# Altium project UTAT_data handling.PrjPcb
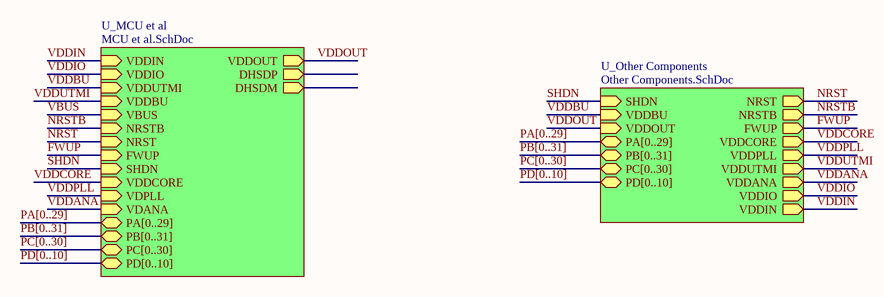
[diagram p0: Top Level.SchDoc]
3 sheets, 168 parts. Net scope: hierarchical (ports join the sheet entries above them; power ports are global).
Board files: UTAT_data handling.PcbDoc, UTAT_data handling_v1.pc.PcbDoc
Sheets:
  Top Level.SchDoc
    U_MCU et al = MCU et al.SchDoc
    U_Other Components = Other Components.SchDoc

## Sheet Top Level.SchDoc
size A

### Sub-sheets
U_MCU et al = MCU et al.SchDoc: VDDOUT (out), VDDIN (in), VDDIO (in), VDDUTMI (in), VDDBU (in), DHSDP (out), DHSDM (out), VBUS (in), NRSTB (in), NRST (in), FWUP (in), SHDN (in), VDDCORE (in), VDPLL (in), VDANA (in), PA[0..29] (bidir), PB[0..31] (bidir), PC[0..30] (bidir), PD[0..10] (bidir)
U_Other Components = Other Components.SchDoc: SHDN (in), NRST (out), NRSTB (out), VDDBU (in), FWUP (out), VDDOUT (in), VDDCORE (out), VDDPLL (out), VDDUTMI (out), VDDANA (out), VDDIO (out), VDDIN (out), PA[0..29] (bidir), PB[0..31] (bidir), PC[0..30] (bidir), PD[0..10] (bidir)

### Nets
FWUP: sheet U_MCU et al/FWUP, sheet U_Other Components/FWUP
NRST: sheet U_MCU et al/NRST, sheet U_Other Components/NRST
NRSTB: sheet U_MCU et al/NRSTB, sheet U_Other Components/NRSTB
SHDN: sheet U_MCU et al/SHDN, sheet U_Other Components/SHDN  [project net PT5]
VDDANA: sheet U_MCU et al/VDANA, sheet U_Other Components/VDDANA  [project net PT14]
VDDBU: sheet U_MCU et al/VDDUTMI, sheet U_Other Components/VDDBU  [project net PT3]
VDDCORE: sheet U_MCU et al/VDDCORE, sheet U_Other Components/VDDCORE  [project net P10]
VDDIN: sheet U_MCU et al/VDDIN, sheet U_Other Components/VDDIN  [project net PU8]
VDDIO: sheet U_MCU et al/VDDIO, sheet U_Other Components/VDDIO  [project net PD9]
VDDOUT: sheet U_MCU et al/VDDOUT, sheet U_Other Components/VDDOUT  [project net PU7]
VDDPLL: sheet U_MCU et al/VDPLL, sheet U_Other Components/VDDPLL  [project net PN1]
VDDUTMI: sheet U_MCU et al/VDDBU, sheet U_Other Components/VDDUTMI  [project net P8]

### Buses and harness runs
bus PA[0..29] = sheet U_MCU et al/PA[0..29]
bus PA[0..29] = sheet U_Other Components/PA[0..29]
bus PB[0..31] = sheet U_MCU et al/PB[0..31]
bus PB[0..31] = sheet U_Other Components/PB[0..31]
bus PC[0..30] = sheet U_MCU et al/PC[0..30]
bus PC[0..30] = sheet U_Other Components/PC[0..30]
bus PD[0..10] = sheet U_MCU et al/PD[0..10]
bus PD[0..10] = sheet U_Other Components/PD[0..10]

## Sheet MCU et al.SchDoc: MCU et al
size A3; DrawnBy: J Gray; Engineer: J Gray; SheetNumber: 1; SheetTotal: 1
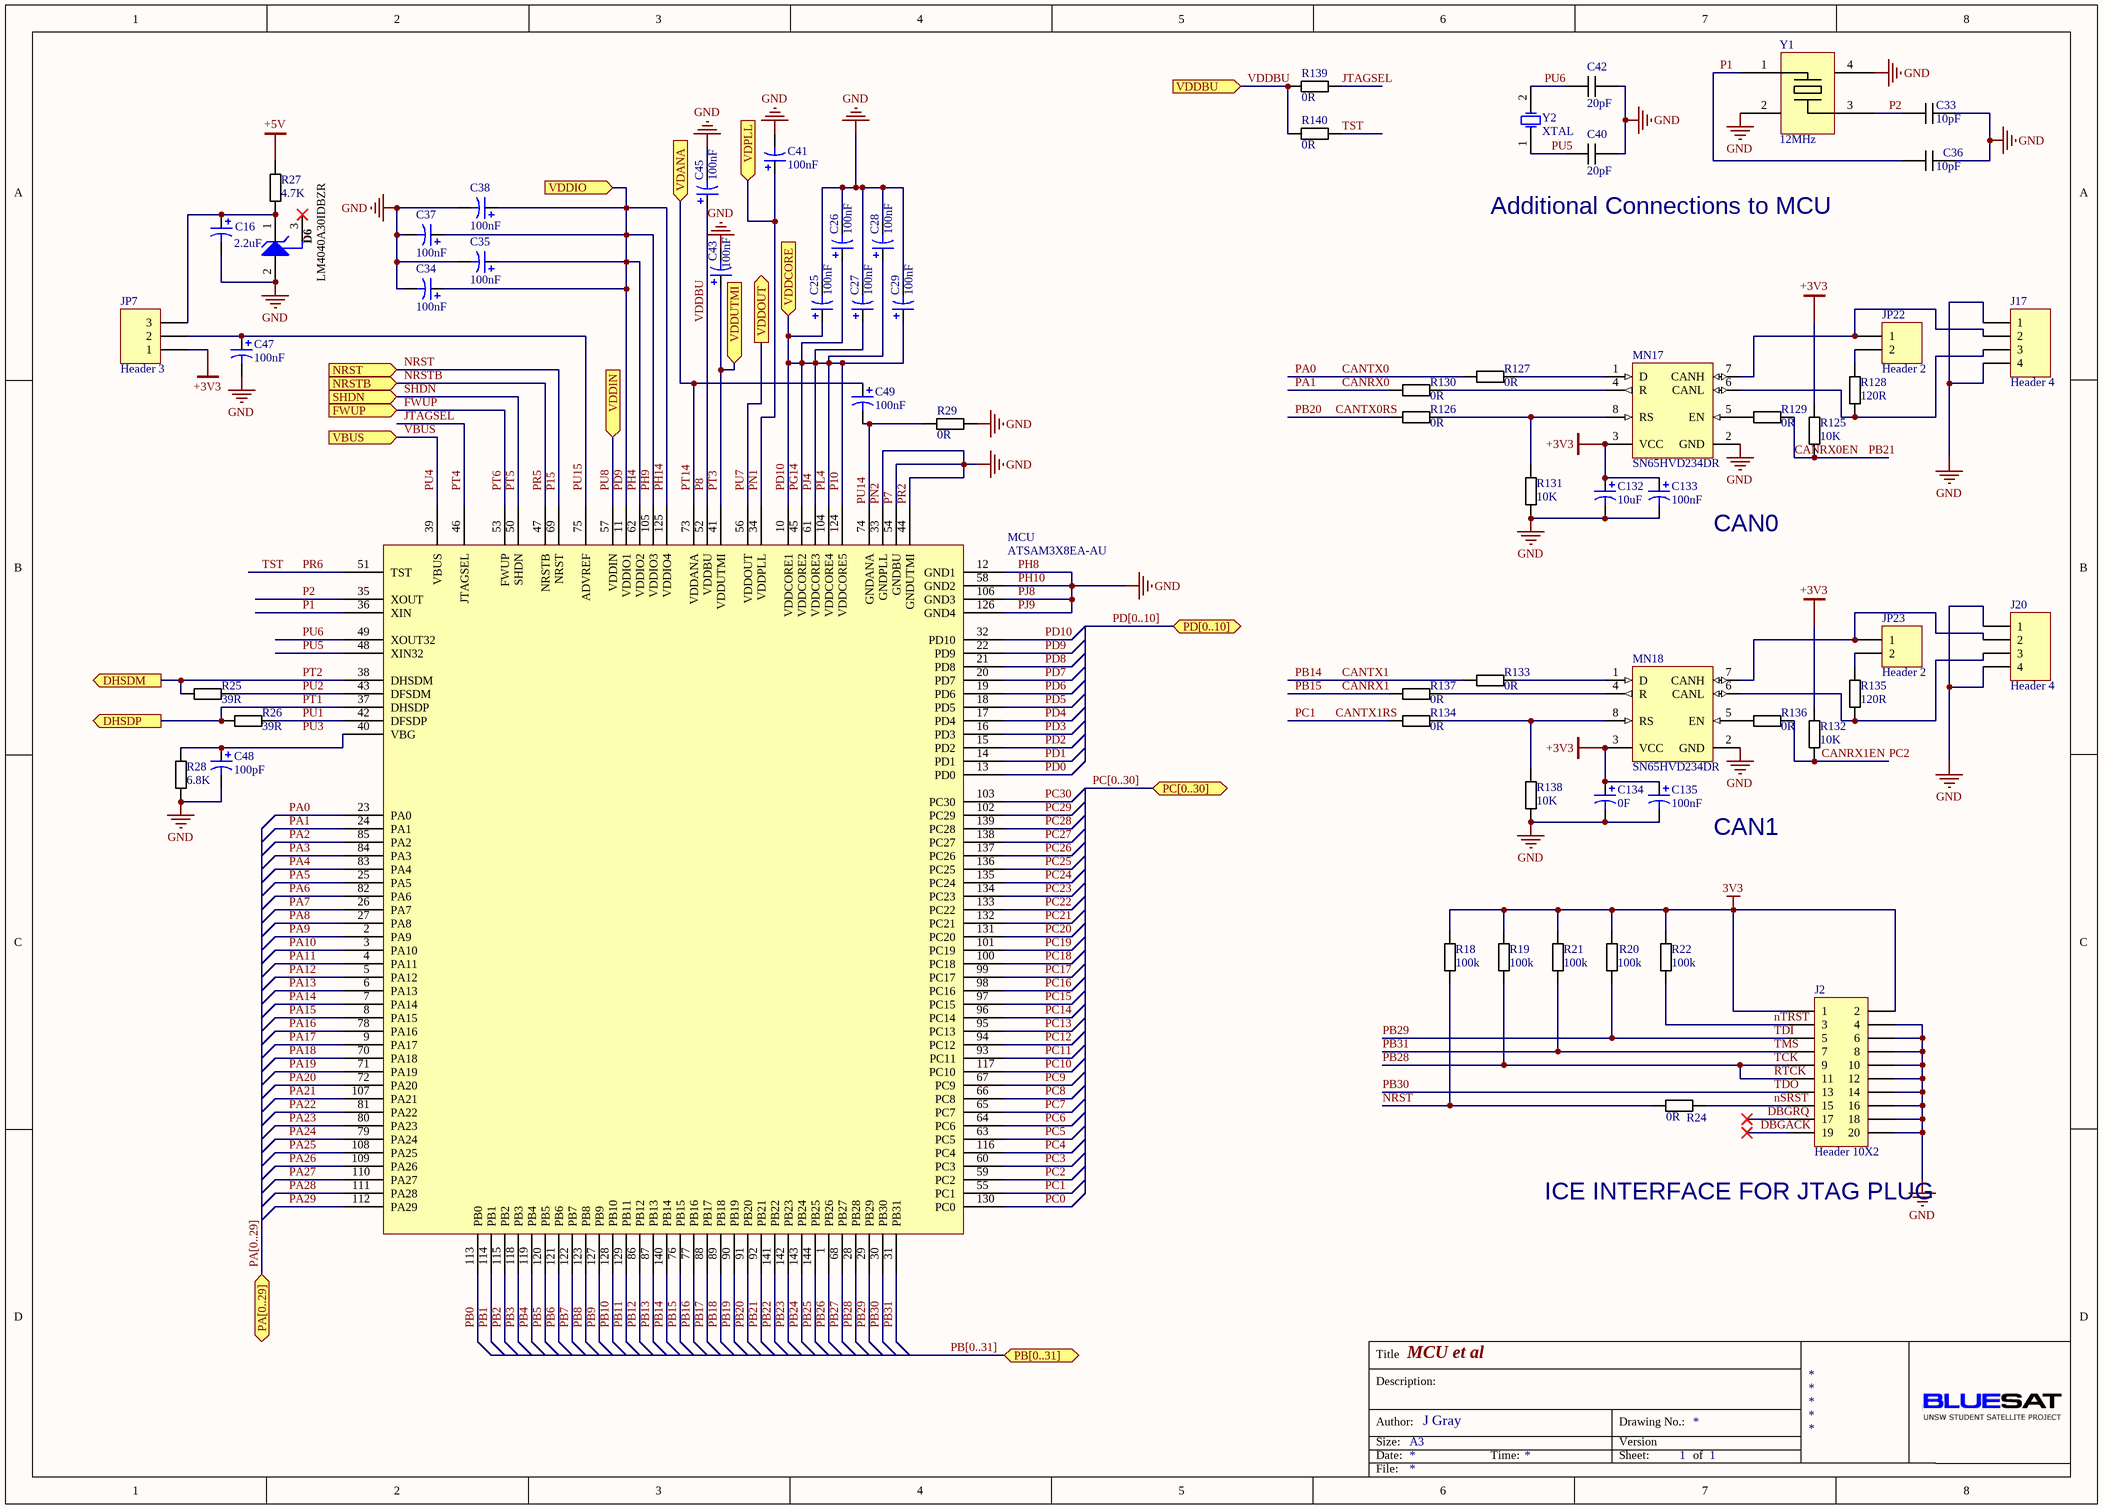
[diagram p1: MCU et al.SchDoc]

### Parts
C16  value 2.2uF  [0805 Cap]  (hidden comment: Cap Pol3)
C25  value 100nF  [0805 Cap]  (hidden comment: Cap Pol3)
C26  value 100nF  [0805 Cap]  (hidden comment: Cap Pol3)
C27  value 100nF  [0805 Cap]  (hidden comment: Cap Pol3)
C28  value 100nF  [0805 Cap]  (hidden comment: Cap Pol3)
C29  value 100nF  [0805 Cap]  (hidden comment: Cap Pol3)
C33  value 10pF  [0805 Cap]  (hidden comment: 0805 Cap)
C34  value 100nF  [0805 Cap]  (hidden comment: Cap Pol3)
C35  value 100nF  [0805 Cap]  (hidden comment: Cap Pol3)
C36  value 10pF  [0805 Cap]  (hidden comment: 0805 Cap)
C37  value 100nF  [0805 Cap]  (hidden comment: Cap Pol3)
C38  value 100nF  [0805 Cap]  (hidden comment: Cap Pol3)
C40  value 20pF  [0805 Cap]  (hidden comment: 0805 Cap)
C41  value 100nF  [0805 Cap]  (hidden comment: Cap Pol3)
C42  value 20pF  [0805 Cap]  (hidden comment: 0805 Cap)
C43  value 100nF  [0805 Cap]  (hidden comment: Cap Pol3)
C45  value 100nF  [0805 Cap]  (hidden comment: Cap Pol3)
C47  value 100nF  [0805 Cap]  (hidden comment: Cap Pol3)
C48  value 100pF  [0805 Cap]  (hidden comment: Cap Pol3)
C49  value 100nF  [0805 Cap]  (hidden comment: Cap Pol3)
C132  value 10uF  [0805 Cap]  (hidden comment: Cap Pol3)
C133  value 100nF  [0805 Cap]  (hidden comment: Cap Pol3)
C134  value 0F  [0805 Cap]  (hidden comment: Cap Pol3)
C135  value 100nF  [0805 Cap]  (hidden comment: Cap Pol3)
D6  LM4040A30IDBZR  [TI-DBZ3_N]
J2  Header 10X2  [HDR2X10 (JTAG)]
J17  Header 4  [HDR1X4]
J20  Header 4  [HDR1X4]
JP7  Header 3  [HDR1X3]
JP22  Header 2  [HDR1X2]
JP23  Header 2  [HDR1X2]
MCU  ATSAM3X8EA-AU  [LQFP144_M]
MN17  SN65HVD234DR  [D8_L]
MN18  SN65HVD234DR  [D8_L]
R18  value 100k  [0805 Resistor]  (hidden comment: 0805 Resistor)
R19  value 100k  [0805 Resistor]  (hidden comment: 0805 Resistor)
R20  value 100k  [0805 Resistor]  (hidden comment: 0805 Resistor)
R21  value 100k  [0805 Resistor]  (hidden comment: 0805 Resistor)
R22  value 100k  [0805 Resistor]  (hidden comment: 0805 Resistor)
R24  value 0R  [0805 Resistor]  (hidden comment: 0805 Resistor)
R25  value 39R  [0805 Resistor]  (hidden comment: 0805 Resistor)
R26  value 39R  [0805 Resistor]  (hidden comment: 0805 Resistor)
R27  value 4.7K  [0805 Resistor]  (hidden comment: 0805 Resistor)
R28  value 6.8K  [0805 Resistor]  (hidden comment: 0805 Resistor)
R29  value 0R  [0805 Resistor]  (hidden comment: 0805 Resistor)
R125  value 10K  [0805 Resistor]  (hidden comment: 0805 Resistor)
R126  value 0R  [0805 Resistor]  (hidden comment: 0805 Resistor)
R127  value 0R  [0805 Resistor]  (hidden comment: 0805 Resistor)
R128  value 120R  [0805 Resistor]  (hidden comment: 0805 Resistor)
R129  value 0R  [0805 Resistor]  (hidden comment: 0805 Resistor)
R130  value 0R  [0805 Resistor]  (hidden comment: 0805 Resistor)
R131  value 10K  [0805 Resistor]  (hidden comment: 0805 Resistor)
R132  value 10K  [0805 Resistor]  (hidden comment: 0805 Resistor)
R133  value 0R  [0805 Resistor]  (hidden comment: 0805 Resistor)
R134  value 0R  [0805 Resistor]  (hidden comment: 0805 Resistor)
R135  value 120R  [0805 Resistor]  (hidden comment: 0805 Resistor)
R136  value 0R  [0805 Resistor]  (hidden comment: 0805 Resistor)
R137  value 0R  [0805 Resistor]  (hidden comment: 0805 Resistor)
R138  value 10K  [0805 Resistor]  (hidden comment: 0805 Resistor)
R139  value 0R  [0805 Resistor]  (hidden comment: 0805 Resistor)
R140  value 0R  [0805 Resistor]  (hidden comment: 0805 Resistor)
Y1  12MHz  [7V-12.000MAAE-T]
Y2  XTAL  [ABS07]

### Ports
DHSDM (out), DHSDP (out), FWUP (in), NRST (in), NRSTB (in), PA[0..29] (bidir), PB[0..31] (bidir), PC[0..30] (bidir), PD[0..10] (bidir), SHDN (in), VBUS (in), VDANA (in), VDDBU (in), VDDCORE (in), VDDIN (in), VDDIO (in), VDDOUT (out), VDDUTMI (in), VDPLL (in)

### Nets
3V3: J2.1 J2.2 R18.2 R19.2 R20.2 R21.2 R22.2
+3V3: C132.1 C133.1 C134.1 C135.1 JP7.1 MN17.3(VCC) MN18.3(VCC) R125.2 R132.2
+5V: R27.2
P7: C16.2 C25.2 C26.2 C27.2 C28.2 C29.2 C33.2 C34.2 C35.2 C36.2 C37.2 C38.2 C40.2 C41.2 C42.2 C43.2 C45.2 C47.2 C48.2 C132.2 C133.2 C134.2 C135.2 D6.2(ANODE) J2.4 J2.6 J2.8 J2.10 J2.12 J2.14 J2.16 J2.18 J2.20 J17.1 J17.4 J20.1 J20.4 MCU.12(GND1) MCU.33(GNDPLL) MCU.44(GNDUTMI) MCU.54(GNDBU) MCU.58(GND2) MCU.106(GND3) MCU.126(GND4) MN17.2(GND) MN18.2(GND) R28.1 R29.1 R131.1 R138.1 Y1.2 Y1.4  [also labelled GND, PH10, PH8, PJ8, PJ9, PN2, PR2]
CANRX0: MCU.24(PA1) R130.1  [also labelled PA1]
CANRX0EN: MCU.92(PB21) R125.1 R129.2  [also labelled PB21]
CANRX1: MCU.76(PB15) R137.1  [also labelled PB15]
CANRX1EN: MCU.59(PC2) R132.1 R136.2  [also labelled PC2]
CANTX0: MCU.23(PA0) R127.1  [also labelled PA0]
CANTX0RS: MCU.91(PB20) R126.1  [also labelled PB20]
CANTX1: MCU.140(PB14) R133.1  [also labelled PB14]
CANTX1RS: MCU.55(PC1) R134.1  [also labelled PC1]
DBGACK: J2.19
DBGRQ: J2.17
FWUP: MCU.53(FWUP) ; port FWUP  [also labelled PT6]
JTAGSEL: MCU.46(JTAGSEL) R139.2  [also labelled PT4]
NRST: MCU.69(NRST) R18.1 R24.1 ; port NRST  [also labelled P15]
NRSTB: MCU.47(NRSTB) ; port NRSTB  [also labelled PR5]
nSRST: J2.15 R24.2
nTRST: J2.3 R22.1
P1: C36.1 MCU.36(XIN) Y1.1
P2: C33.1 MCU.35(XOUT) Y1.3
P8: C45.1 MCU.52(VDDBU) R139.1 R140.1 ; port VDDBU  [also labelled VDDBU]
P10: C25.1 C26.1 C27.1 C28.1 C29.1 MCU.10(VDDCORE1) MCU.32(PD10) MCU.45(VDDCORE2) MCU.61(VDDCORE3) MCU.104(VDDCORE4) MCU.124(VDDCORE5) ; port VDDCORE  [also labelled PD10, PG14, PJ4, PL4]
PA2: MCU.85(PA2)
PA3: MCU.84(PA3)
PA4: MCU.83(PA4)
PA5: MCU.25(PA5)
PA6: MCU.82(PA6)
PA7: MCU.26(PA7)
PA8: MCU.27(PA8)  [project net (URXD)]
PA9: MCU.2(PA9)  [project net (UTXD)]
PA10: MCU.3(PA10)
PA11: MCU.4(PA11)
PA12: MCU.5(PA12)
PA13: MCU.6(PA13)
PA14: MCU.7(PA14)
PA15: MCU.8(PA15)
PA16: MCU.78(PA16)
PA17: MCU.9(PA17)
PA18: MCU.70(PA18)
PA19: MCU.71(PA19)
PA20: MCU.72(PA20)
PA21: MCU.107(PA21)
PA22: MCU.81(PA22)
PA23: MCU.80(PA23)
PA24: MCU.79(PA24)
PA25: MCU.108(PA25)
PA26: MCU.109(PA26)
PA27: MCU.110(PA27)
PA28: MCU.111(PA28)
PA29: MCU.112(PA29)
PB0: MCU.113(PB0)
PB1: MCU.114(PB1)
PB2: MCU.115(PB2)
PB3: MCU.118(PB3)
PB4: MCU.119(PB4)
PB5: MCU.120(PB5)
PB6: MCU.121(PB6)
PB7: MCU.122(PB7)
PB8: MCU.123(PB8)
PB9: MCU.127(PB9)
PB10: MCU.128(PB10)
PB11: MCU.129(PB11)
PB12: MCU.86(PB12)
PB13: MCU.87(PB13)
PB16: MCU.77(PB16)
PB17: MCU.88(PB17)
PB18: MCU.89(PB18)
PB19: MCU.90(PB19)
PB22: MCU.141(PB22)
PB23: MCU.142(PB23)
PB24: MCU.143(PB24)
PB25: MCU.144(PB25)
PB26: MCU.1(PB26)
PB27: MCU.68(PB27)
PB28: J2.9 J2.11 MCU.28(PB28) R19.1  [also labelled RTCK, TCK]
PB29: J2.5 MCU.29(PB29) R20.1  [also labelled TDI]
PB30: J2.13 MCU.30(PB30)  [also labelled TDO]
PB31: J2.7 MCU.31(PB31) R21.1  [also labelled TMS]
PC0: MCU.130(PC0)
PC3: MCU.60(PC3)  [project net COM0_EN]
PC4: MCU.116(PC4)
PC5: MCU.63(PC5)
PC6: MCU.64(PC6)
PC7: MCU.65(PC7)
PC8: MCU.66(PC8)
PC9: MCU.67(PC9)
PC10: MCU.117(PC10)
PC11: MCU.93(PC11)
PC12: MCU.94(PC12)
PC13: MCU.95(PC13)
PC14: MCU.96(PC14)
PC15: MCU.97(PC15)
PC16: MCU.98(PC16)
PC17: MCU.99(PC17)
PC18: MCU.100(PC18)
PC19: MCU.101(PC19)
PC20: MCU.131(PC20)
PC21: MCU.132(PC21)
PC22: MCU.133(PC22)
PC23: MCU.134(PC23)
PC24: MCU.135(PC24)
PC25: MCU.136(PC25)
PC26: MCU.137(PC26)
PC27: MCU.138(PC27)
PC28: MCU.139(PC28)
PC29: MCU.102(PC29)
PC30: MCU.103(PC30)
PD0: MCU.13(PD0)
PD1: MCU.14(PD1)
PD2: MCU.15(PD2)
PD3: MCU.16(PD3)
PD4: MCU.17(PD4)
PD5: MCU.18(PD5)
PD6: MCU.19(PD6)
PD7: MCU.20(PD7)
PD8: MCU.21(PD8)
PD9: C34.1 C35.1 C37.1 C38.1 MCU.11(VDDIO1) MCU.22(PD9) MCU.62(VDDIO2) MCU.105(VDDIO3) MCU.125(VDDIO4) ; port VDDIO  [also labelled PH14, PH4, PH9]
PN1: C41.1 MCU.34(VDDPLL) ; port VDPLL
PR6: MCU.51(TST) R140.2  [also labelled TST]
PT1: MCU.37(DHSDP) R26.1 ; port DHSDP
PT2: MCU.38(DHSDM) R25.1 ; port DHSDM
PT3: C43.1 MCU.41(VDDUTMI) ; port VDDUTMI
PT5: MCU.50(SHDN) ; port SHDN  [also labelled SHDN]
PT14: C49.1 MCU.73(VDDANA) ; port VDANA
PU1: MCU.42(DFSDP) R26.2
PU2: MCU.43(DFSDM) R25.2
PU4: MCU.39(VBUS) ; port VBUS  [also labelled VBUS]
PU5: C40.1 MCU.48(XIN32) Y2.1(OSC1)
PU6: C42.1 MCU.49(XOUT32) Y2.2(OSC2)
PU7: MCU.56(VDDOUT) ; port VDDOUT
PU8: MCU.57(VDDIN) ; port VDDIN
PU14: C49.2 MCU.74(GNDANA) R29.2
PU15: C47.1 JP7.2 MCU.75(ADVREF)
NetC16_1: C16.1 D6.1(CATHODE) JP7.3 R27.1
NetC48_1: C48.1 MCU.40(VBG) R28.2
NetJ17_2: J17.2 JP22.1 MN17.7(CANH)
NetJ17_3: J17.3 MN17.6(CANL) R128.2
NetJ20_2: J20.2 JP23.1 MN18.7(CANH)
NetJ20_3: J20.3 MN18.6(CANL) R135.2
NetJP22_2: JP22.2 R128.1
NetJP23_2: JP23.2 R135.1
NetMN17_1: MN17.1(D) R127.2
NetMN17_4: MN17.4(R) R130.2
NetMN17_5: MN17.5(EN) R129.1
NetMN17_8: MN17.8(RS) R126.2 R131.2
NetMN18_1: MN18.1(D) R133.2
NetMN18_4: MN18.4(R) R137.2
NetMN18_5: MN18.5(EN) R136.1
NetMN18_8: MN18.8(RS) R134.2 R138.2

Not connected (* = marked no-connect by the designer): D6 3(NC)*

### Buses and harness runs
bus PA[0..29] = port PA[0..29]
bus PB[0..31] = port PB[0..31]
bus PC[0..30] = port PC[0..30]
bus PD[0..10] = port PD[0..10]

### Notes on the sheet
- (near C40) Additional Connections to MCU
- CAN0
- CAN1
- ICE INTERFACE FOR JTAG PLUG
- Labels drawn without touching a wire or pin: PU3
- Title
- Description:
- Size:
- Author:
- Date:
- A3
- Time:
- Version
- Sheet:
- Drawing No.:
- of
- File:

### Library data of the parts
C16 C25-C29 C34 C35 C37 C38 C41 C43 C45 C47-C49 C132-C135 = Cap Pol3: Polarized Capacitor (Surface Mount); Published: 8-Jun-2000; LatestRevisionDate: 29-May-2009; LatestRevisionNote: IPC-7351 Footprint Added.; PackageReference: C0805; Publisher: Altium Limited; PackageDescription: Chip Capacitor
C33 C36 C40 C42 = 0805 MLCC - X7R, 10%
D6 = LM4040A30IDBZR: Precision Micropower Shunt Voltage Reference, 0.1% accuracy, 3 V, 15 ppm / degC, 15 mA, -40 to 85 degC, 3-pin SOT-23 (DBZ), Green (RoHS & no Sb/Br); Manufacturer: Texas Instruments; Initial Accuracy @ 25/deg C(%): 0.1; Iout/Iz(Max)(mA): 15; Min Iz for Regulation(uA): 62; Rating: Catalog; Temp Coeff(Max)(ppm/ degree C): 100; VO(V): 3; DatasheetVersion: SLOS456K; PackageVersion: 4203227/B; PackageReference: DBZ3; PackageDescription: 3-Pin Plastic Small Outline, Body 2.92 x 1.3 mm, Pitch 0.95 mm; Supplier 1: Digi-Key; Supplier Part Number 1: 296-20861-2-ND; Supplier 2: Digi-Key; Supplier Part Number 2: 296-20861-1-ND; Supplier 3: Digi-Key; Supplier Part Number 3: 296-20861-6-ND; Supplier 4: Newark; Supplier Part Number 4: 66K2439; Supplier 5: Mouser; Supplier Part Number 5: 595-LM4040A30IDBZR; Eco-Plan: Green (RoHS & no Sb/Br); SubFamily: Shunt Voltage Reference; Temp Coeff(Typ)(ppm/ degree C): 15; Mounting Technology: Surface Mount; Code_JEDEC: TO-236; PartNumber: LM4040A30IDBZR; ComponentLink1Description: Manufacturer URL; ComponentLink1URL: http://www.ti.com/; ComponentLink2Description: Datasheet; ComponentLink2URL: http://www.ti.com/general/docs/lit/getliterature.tsp?genericPartNumber=LM4040A30&fileType=pdf; ComponentLink3Description: Package Specification; ComponentLink3URL: http://www.ti.com/litv/pdf/mpds108a
J2 = Header 10X2: Header, 10-Pin, Dual row; LatestRevisionDate: 17-Jul-2002; LatestRevisionNote: Re-released for DXP Platform.; Publisher: Altium Limited
J17 J20 = Header 4: Header, 4-Pin; LatestRevisionDate: 17-Jul-2002; LatestRevisionNote: Re-released for DXP Platform.; Publisher: Altium Limited
JP7 = Header 3: Header, 3-Pin, fix symbol later; LatestRevisionDate: 17-Jul-2002; LatestRevisionNote: Re-released for DXP Platform.; Publisher: Altium Limited
JP22 JP23 = Header 2: Header, 2-Pin; Manufacturer: Molex; Supplier: Digikey; Supplier P/N: WM6440-ND; Manufacturer P/N: 22-28-4025
MCU = ATSAM3X8E: ATSAM3X8EA-AU ARM CORTEX M3 Microcontroller
MN17 = SN65HVD234DR: 3.3V CAN Transceiver with Sleep Mode, 6 mA, -40 to Digi-Key Number 296-27991-1-ND; Manufacturer: Texas Instruments; Eco-Plan: Green (RoHS & no Sb/Br); Drivers Per Package: 1; Isolated: No; Bus Fault Voltage(V): +/-30; Transient Pulse Protection(V): -100 to 100; ICC(Max)(mA): 6; Supply Voltage(s)(V): 3.3; Rating: Catalog; DatasheetVersion: SLLS557F; PackageVersion: revM, Jun-2011; PackageReference: D8; PackageDescription: 8-Pin Plastic Small Outline Integrated Circuit, 4.9 x 3.9 mm, Pitch 1.27 mm Pitch; Supplier 1: Digi-Key; Supplier Part Number 1: 296-27991-2-ND; Supplier 2: Digi-Key; Supplier Part Number 2: 296-27991-1-ND; Supplier 3: Digi-Key; Supplier Part Number 3: 296-27991-6-ND; Supplier 4: Farnell; Supplier Part Number 4: 1408716; Supplier 5: Newark; Supplier Part Number 5: 73H4408; Supplier 6: Mouser; Supplier Part Number 6: 595-SN65HVD234DR; SubFamily: CAN; Receivers Per Package: 1; Low Power Mode: Sleep; Footprint: PCA82C250, excludes pin5; Mounting Technology: Surface Mount; PartNumber: SN65HVD234DR; Code_JEDEC: MS-012AA; ComponentLink1Description: Datasheet; ComponentLink1URL: http://www.ti.com/general/docs/lit/getliterature.tsp?genericPartNumber=SN65HVD234&fileType=pdf
MN18 = SN65HVD234DR: Digi-Key Number 296-27991-1-ND; Manufacturer: Texas Instruments; Eco-Plan: Green (RoHS & no Sb/Br); SubFamily: CAN; Drivers Per Package: 1; Isolated: No; Bus Fault Voltage(V): +/-30; Transient Pulse Protection(V): -100 to 100; Low Power Mode: Sleep; ICC(Max)(mA): 6; Supply Voltage(s)(V): 3.3; Rating: Catalog; DatasheetVersion: SLLS557F; PackageVersion: revM, Jun-2011; PackageReference: D8; PackageDescription: 8-Pin Plastic Small Outline Integrated Circuit, 4.9 x 3.9 mm, Pitch 1.27 mm Pitch; Supplier 1: Digi-Key; Supplier Part Number 1: 296-27991-2-ND; Supplier 2: Digi-Key; Supplier Part Number 2: 296-27991-1-ND; Supplier 3: Digi-Key; Supplier Part Number 3: 296-27991-6-ND; Supplier 4: Farnell; Supplier Part Number 4: 1408716; Supplier 5: Newark; Supplier Part Number 5: 73H4408; Supplier 6: Mouser; Supplier Part Number 6: 595-SN65HVD234DR; Receivers Per Package: 1; Footprint: PCA82C250, excludes pin5; Mounting Technology: Surface Mount; PartNumber: SN65HVD234DR; Code_JEDEC: MS-012AA; ComponentLink1Description: Datasheet; ComponentLink1URL: http://www.ti.com/general/docs/lit/getliterature.tsp?genericPartNumber=SN65HVD234&fileType=pdf
R18-R22 R24-R29 R125-R140 = 0805 Thick Film Resistor 1%
Y1 = 4-Pin Oscillator: Digi-Key Part Number 887-1458-1-ND
Y2 = XTAL: Digikey Number: 535-9544-1-ND; Published: 8-Jun-2000; LatestRevisionDate: 17-Jul-2002; LatestRevisionNote: Re-released for DXP Platform.; PackageReference: R38; Publisher: Altium Limited; PackageDescription: Crystal, Thru-Hole; 2 Leads; Body 3.1 x 8.2 mm (Dia.xH)

## Sheet Other Components.SchDoc: Other Components
size A3; SheetNumber: 1; SheetTotal: 1
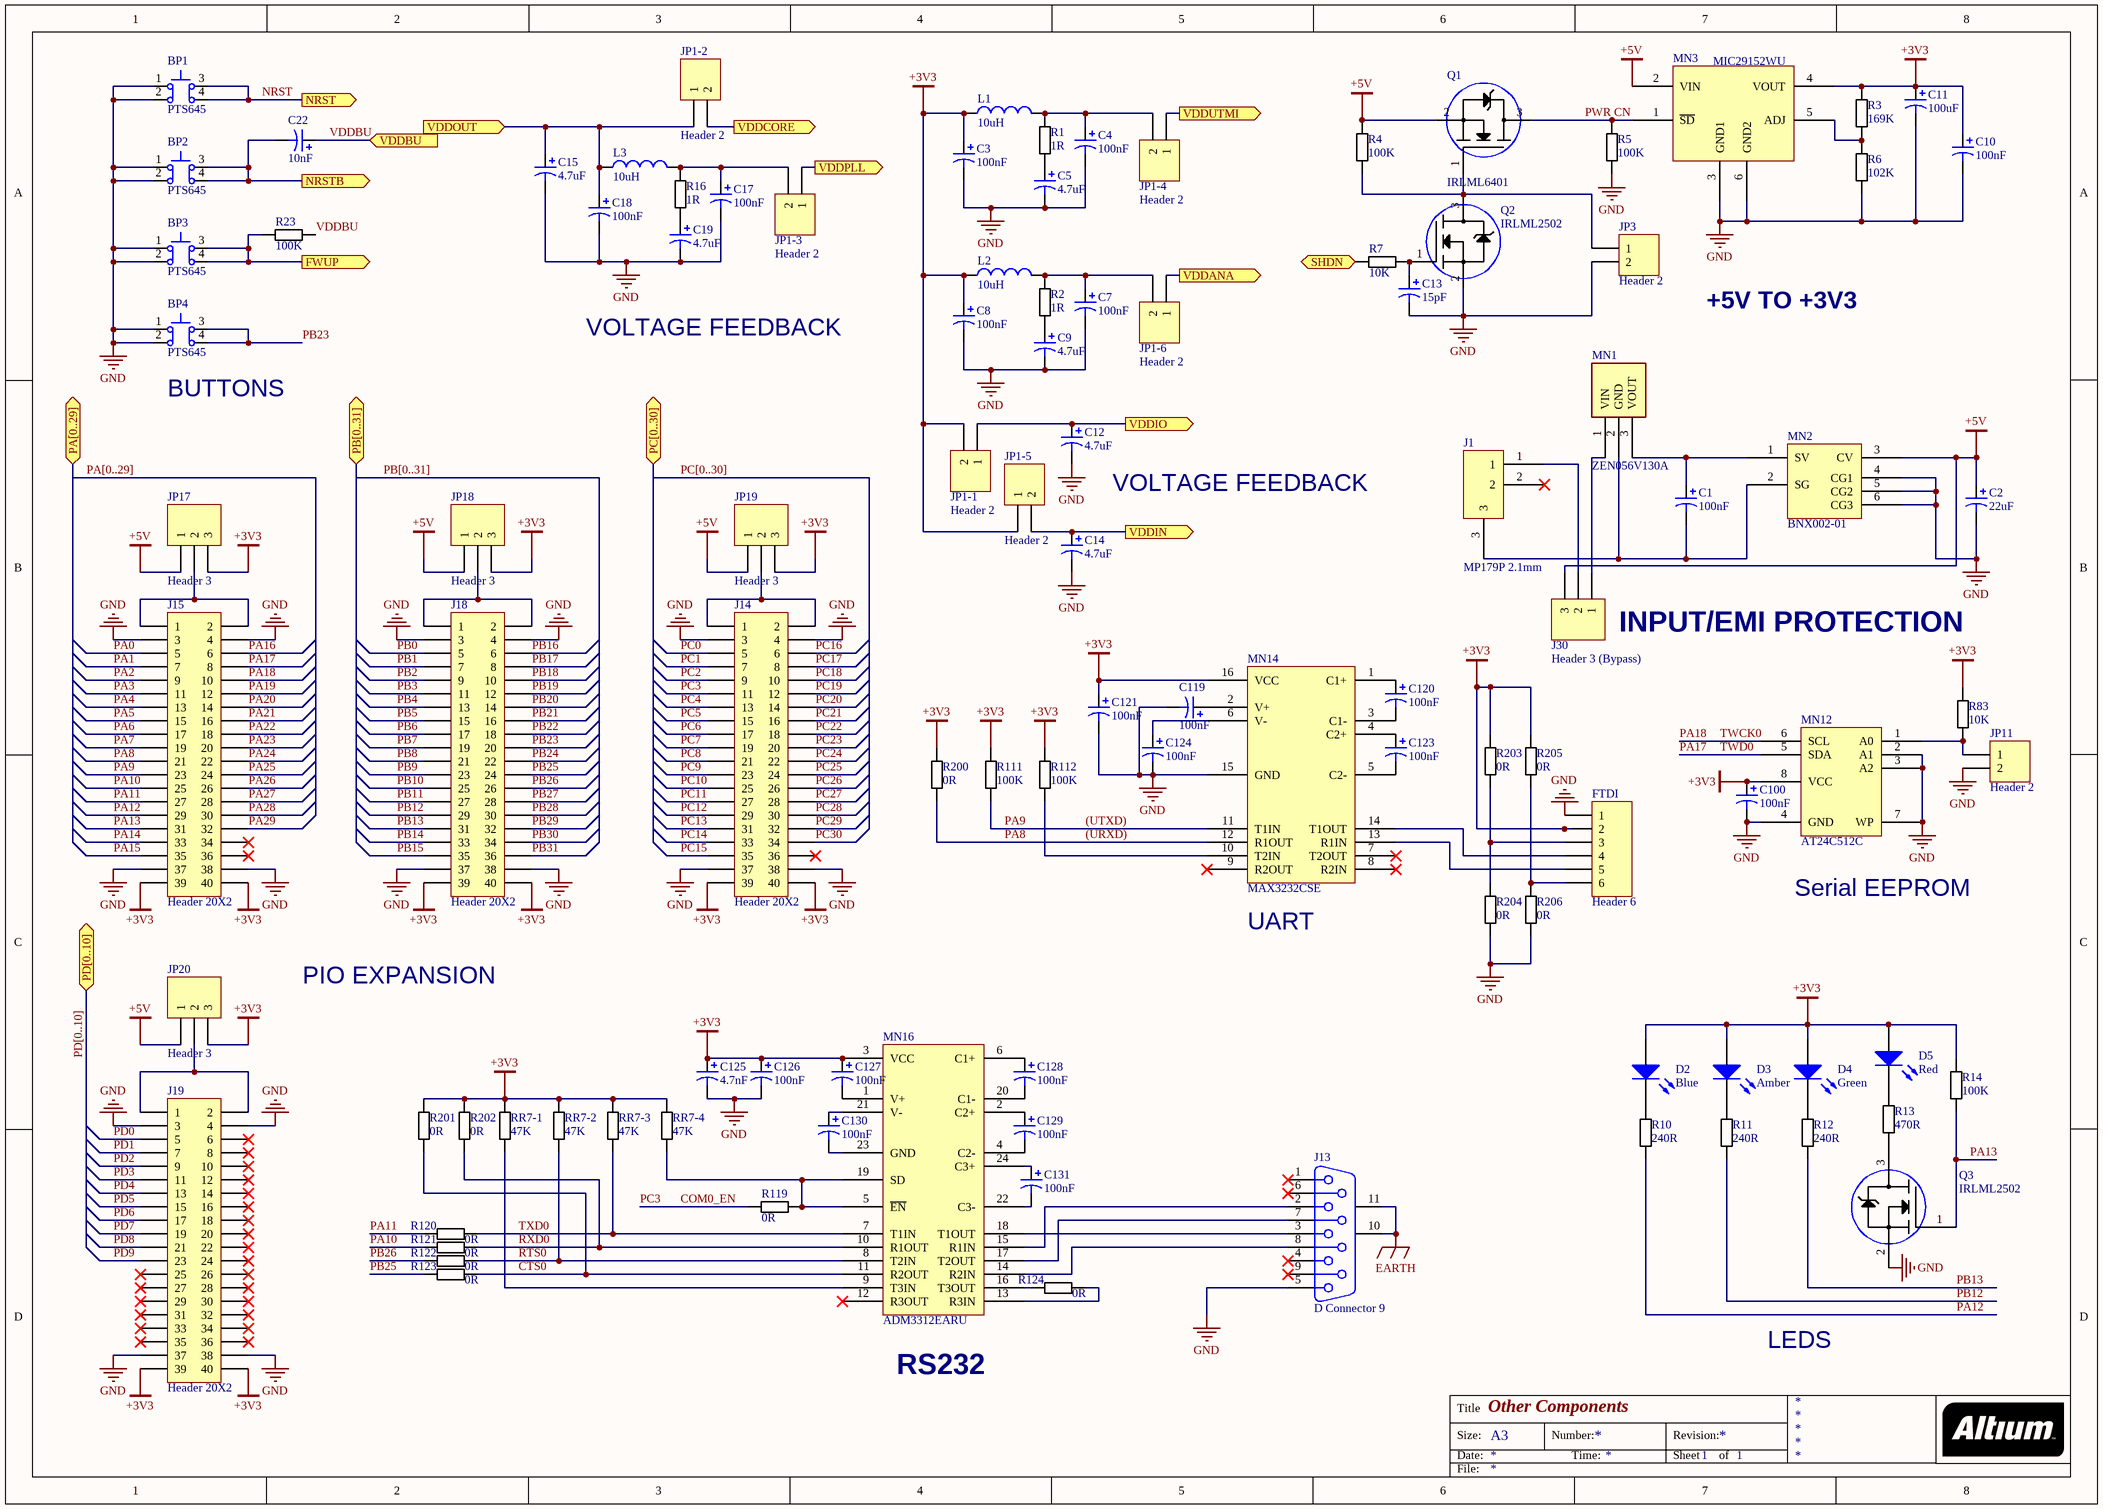
[diagram p2: Other Components.SchDoc]

### Parts
BP1  PTS645  [PTS645]
BP2  PTS645  [PTS645]
BP3  PTS645  [PTS645]
BP4  PTS645  [PTS645]
C1  value 100nF  [0805 Cap]  (hidden comment: Cap Pol3)
C2  value 22uF  [0805 Cap]  (hidden comment: Cap Pol3)
C3  value 100nF  [0805 Cap]  (hidden comment: Cap Pol3)
C4  value 100nF  [0805 Cap]  (hidden comment: Cap Pol3)
C5  value 4.7uF  [0805 Cap]  (hidden comment: Cap Pol3)
C7  value 100nF  [0805 Cap]  (hidden comment: Cap Pol3)
C8  value 100nF  [0805 Cap]  (hidden comment: Cap Pol3)
C9  value 4.7uF  [0805 Cap]  (hidden comment: Cap Pol3)
C10  value 100nF  [0805 Cap]  (hidden comment: Cap Pol3)
C11  value 100uF  [0805 Cap]  (hidden comment: Cap Pol3)
C12  value 4.7uF  [0805 Cap]  (hidden comment: Cap Pol3)
C13  value 15pF  [0805 Cap]  (hidden comment: Cap Pol3)
C14  value 4.7uF  [0805 Cap]  (hidden comment: Cap Pol3)
C15  value 4.7uF  [0805 Cap]  (hidden comment: Cap Pol3)
C17  value 100nF  [0805 Cap]  (hidden comment: Cap Pol3)
C18  value 100nF  [0805 Cap]  (hidden comment: Cap Pol3)
C19  value 4.7uF  [0805 Cap]  (hidden comment: Cap Pol3)
C22  value 10nF  [0805 Cap]  (hidden comment: Cap Pol3)
C100  value 100nF  [0805 Cap]  (hidden comment: Cap Pol3)
C119  value 100nF  [0805 Cap]  (hidden comment: Cap Pol3)
C120  value 100nF  [0805 Cap]  (hidden comment: Cap Pol3)
C121  value 100nF  [0805 Cap]  (hidden comment: Cap Pol3)
C123  value 100nF  [0805 Cap]  (hidden comment: Cap Pol3)
C124  value 100nF  [0805 Cap]  (hidden comment: Cap Pol3)
C125  value 4.7nF  [0805 Cap]  (hidden comment: Cap Pol3)
C126  value 100nF  [0805 Cap]  (hidden comment: Cap Pol3)
C127  value 100nF  [0805 Cap]  (hidden comment: Cap Pol3)
C128  value 100nF  [0805 Cap]  (hidden comment: Cap Pol3)
C129  value 100nF  [0805 Cap]  (hidden comment: Cap Pol3)
C130  value 100nF  [0805 Cap]  (hidden comment: Cap Pol3)
C131  value 100nF  [0805 Cap]  (hidden comment: Cap Pol3)
D2  Blue  [0805 LED]
D3  Amber  [0805 LED]
D4  Green  [0805 LED]
D5  Red  [0805 LED]
FTDI  Header 6  [HDR1X6]
J1  MP179P 2.1mm  [2.1mm Jack]
J13  D Connector 9  [DSUB1.385-2H9]
J14  Header 20X2  [HDR2X20]
J15  Header 20X2  [HDR2X20]
J18  Header 20X2  [HDR2X20]
J19  Header 20X2  [HDR2X20]
J30  Header 3 (Bypass)  [HDR1X3]
JP1-1  Header 2  [HDR1X2]
JP1-2  Header 2  [HDR1X2]
JP1-3  Header 2  [HDR1X2]
JP1-4  Header 2  [HDR1X2]
JP1-5  Header 2  [HDR1X2]
JP1-6  Header 2  [HDR1X2]
JP3  Header 2  [HDR1X2]
JP11  Header 2  [HDR1X2]
JP17  Header 3  [HDR1X3]
JP18  Header 3  [HDR1X3]
JP19  Header 3  [HDR1X3]
JP20  Header 3  [HDR1X3]
L1  value 10uH  [0805 Resistor]  (hidden comment: Inductor)
L2  value 10uH  [0805 Resistor]  (hidden comment: Inductor)
L3  value 10uH  [0805 Resistor]  (hidden comment: Inductor)
MN1  ZEN056V130A  [ZEN056V130A24L]
MN2  BNX002-01  [BNX002]
MN3  MIC29152WU  [MIC29152WU]
MN12  AT24C512C  [AT24C512C]
MN14  MAX3232CSE  [SOIC127P570X175-16N]
MN16  ADM3312EARU  [TSOP65P640X120-24N]
Q1  IRLML6401  [3 Pin SOT-23]
Q2  IRLML2502  [3 Pin SOT-23]
Q3  IRLML2502  [3 Pin SOT-23]
R1  value 1R  [0805 Resistor]  (hidden comment: 0805 Resistor)
R2  value 1R  [0805 Resistor]  (hidden comment: 0805 Resistor)
R3  value 169K  [0805 Resistor]  (hidden comment: 0805 Resistor)
R4  value 100K  [0805 Resistor]  (hidden comment: 0805 Resistor)
R5  value 100K  [0805 Resistor]  (hidden comment: 0805 Resistor)
R6  value 102K  [0805 Resistor]  (hidden comment: 0805 Resistor)
R7  value 10K  [0805 Resistor]  (hidden comment: 0805 Resistor)
R10  value 240R  [0805 Resistor]  (hidden comment: 0805 Resistor)
R11  value 240R  [0805 Resistor]  (hidden comment: 0805 Resistor)
R12  value 240R  [0805 Resistor]  (hidden comment: 0805 Resistor)
R13  value 470R  [0805 Resistor]  (hidden comment: 0805 Resistor)
R14  value 100K  [0805 Resistor]  (hidden comment: 0805 Resistor)
R16  value 1R  [0805 Resistor]  (hidden comment: 0805 Resistor)
R23  value 100K  [0805 Resistor]  (hidden comment: 0805 Resistor)
R83  value 10K  [0805 Resistor]  (hidden comment: 0805 Resistor)
R111  value 100K  [0805 Resistor]  (hidden comment: 0805 Resistor)
R112  value 100K  [0805 Resistor]  (hidden comment: 0805 Resistor)
R119  value 0R  [0805 Resistor]  (hidden comment: 0805 Resistor)
R120  value 0R  [0805 Resistor]  (hidden comment: 0805 Resistor)
R121  value 0R  [0805 Resistor]  (hidden comment: 0805 Resistor)
R122  value 0R  [0805 Resistor]  (hidden comment: 0805 Resistor)
R123  value 0R  [0805 Resistor]  (hidden comment: 0805 Resistor)
R124  value 0R  [0805 Resistor]  (hidden comment: 0805 Resistor)
R200  value 0R  [0805 Resistor]  (hidden comment: 0805 Resistor)
R201  value 0R  [0805 Resistor]  (hidden comment: 0805 Resistor)
R202  value 0R  [0805 Resistor]  (hidden comment: 0805 Resistor)
R203  value 0R  [0805 Resistor]  (hidden comment: 0805 Resistor)
R204  value 0R  [0805 Resistor]  (hidden comment: 0805 Resistor)
R205  value 0R  [0805 Resistor]  (hidden comment: 0805 Resistor)
R206  value 0R  [0805 Resistor]  (hidden comment: 0805 Resistor)
RR7-1  value 47K  [0805 Resistor]  (hidden comment: 0805 Resistor)
RR7-2  value 47K  [0805 Resistor]  (hidden comment: 0805 Resistor)
RR7-3  value 47K  [0805 Resistor]  (hidden comment: 0805 Resistor)
RR7-4  value 47K  [0805 Resistor]  (hidden comment: 0805 Resistor)

### Ports
FWUP (out), NRST (out), NRSTB (out), PA[0..29] (bidir), PB[0..31] (bidir), PC[0..30] (bidir), PD[0..10] (bidir), SHDN (in), VDDANA (out), VDDBU (in), VDDCORE (out), VDDIN (out), VDDIO (out), VDDOUT (in), VDDPLL (out), VDDUTMI (out)

### Nets
+3V3: C3.1 C8.1 C10.1 C11.1 C100.1 C121.1 C125.1 C126.1 C127.1 D2.1(A) D3.1(A) D4.1(A) D5.1(A) FTDI.2 J14.39 J14.40 J15.39 J15.40 J18.39 J18.40 J19.39 J19.40 JP1-1.2 JP1-5.1 JP17.3 JP18.3 JP19.3 JP20.3 L1.1 L2.1 MN3.4(VOUT) MN12.8(VCC) MN14.16(VCC) MN16.3(VCC) R3.2 R14.2 R83.2 R111.2 R112.2 R200.2 R201.2 R202.2 R203.2 R205.2 RR7-1.1 RR7-2.1 RR7-3.1 RR7-4.1
+5V: C2.1 J30.3 JP17.1 JP18.1 JP19.1 JP20.1 MN2.3(CV) MN3.2(VIN) Q1.2(S) R4.2
EARTH: J13.10(MH1) J13.11(MH2)
GND: BP1.1 BP1.2 BP2.1 BP2.2 BP3.1 BP3.2 BP4.1 BP4.2 C2.2 C3.2 C4.2 C5.2 C7.2 C8.2 C9.2 C10.2 C11.2 C12.2 C13.2 C14.2 C15.2 C17.2 C18.2 C19.2 C100.2 C119.2 C121.2 C124.2 C125.2 C126.2 FTDI.1 J13.5 J14.3 J14.4 J14.37 J14.38 J15.3 J15.4 J15.37 J15.38 J18.3 J18.4 J18.37 J18.38 J19.3 J19.4 J19.37 J19.38 JP3.2 JP11.2 MN2.4(CG1) MN2.5(CG2) MN2.6(CG3) MN3.3(GND1) MN3.6(GND2) MN12.2(A1) MN12.3(A2) MN12.4(GND) MN12.7(WP) MN14.15(GND) Q2.2(S) R5.1 R6.1 R204.1 R206.1  [project net P7]
(URXD): J15.21 MN14.12(R1OUT) R200.1  [also labelled PA8]
(UTXD): J15.23 MN14.11(T1IN) R111.1  [also labelled PA9]
COM0_EN: J14.11 R119.1  [also labelled PC3]
CTS0: MN16.11(R2OUT) R123.2 R201.1
FWUP: BP3.3 BP3.4 R23.1 ; port FWUP
NRST: BP1.3 BP1.4 ; port NRST
NRSTB: BP2.3 BP2.4 C22.2 ; port NRSTB
P8: JP1-4.1 ; port VDDUTMI
P10: JP1-2.2 ; port VDDCORE
PA0: J15.5  [project net CANTX0]
PA1: J15.7  [project net CANRX0]
PA2: J15.9
PA3: J15.11
PA4: J15.13
PA5: J15.15
PA6: J15.17
PA7: J15.19
PA10: J15.25 R121.1
PA11: J15.27 R120.1
PA12: J15.29 R10.1
PA13: J15.31 R14.1
PA14: J15.33
PA15: J15.35
PA16: J15.6
PA17: J15.8 MN12.5(SDA)  [also labelled TWD0]
PA18: J15.10 MN12.6(SCL)  [also labelled TWCK0]
PA19: J15.12
PA20: J15.14
PA21: J15.16
PA22: J15.18
PA23: J15.20
PA24: J15.22
PA25: J15.24
PA26: J15.26
PA27: J15.28
PA28: J15.30
PA29: J15.32
PB0: J18.5
PB1: J18.7
PB2: J18.9
PB3: J18.11
PB4: J18.13
PB5: J18.15
PB6: J18.17
PB7: J18.19
PB8: J18.21
PB9: J18.23
PB10: J18.25
PB11: J18.27
PB12: J18.29 R11.1
PB13: J18.31 R12.1
PB14: J18.33  [project net CANTX1]
PB15: J18.35  [project net CANRX1]
PB16: J18.6
PB17: J18.8
PB18: J18.10
PB19: J18.12
PB20: J18.14  [project net CANTX0RS]
PB21: J18.16  [project net CANRX0EN]
PB22: J18.18
PB23: BP4.3 BP4.4 J18.20
PB24: J18.22
PB25: J18.24 R123.1
PB26: J18.26 R122.1
PB27: J18.28
PB28: J18.30
PB29: J18.32
PB30: J18.34
PB31: J18.36
PC0: J14.5
PC1: J14.7  [project net CANTX1RS]
PC2: J14.9  [project net CANRX1EN]
PC4: J14.13
PC5: J14.15
PC6: J14.17
PC7: J14.19
PC8: J14.21
PC9: J14.23
PC10: J14.25
PC11: J14.27
PC12: J14.29
PC13: J14.31
PC14: J14.33
PC15: J14.35
PC16: J14.6
PC17: J14.8
PC18: J14.10
PC19: J14.12
PC20: J14.14
PC21: J14.16
PC22: J14.18
PC23: J14.20
PC24: J14.22
PC25: J14.24
PC26: J14.26
PC27: J14.28
PC28: J14.30
PC29: J14.32
PC30: J14.34
PD0: J19.5
PD1: J19.7
PD2: J19.9
PD3: J19.11
PD4: J19.13
PD5: J19.15
PD6: J19.17
PD7: J19.19
PD8: J19.21
PD9: C12.1 J19.23 JP1-1.1 ; port VDDIO
PN1: JP1-3.1 ; port VDDPLL
PT5: R7.2 ; port SHDN
PT14: JP1-6.1 ; port VDDANA
PU7: C15.1 C18.1 JP1-2.1 L3.1 ; port VDDOUT
PU8: C14.1 JP1-5.2 ; port VDDIN
PWR CN: MN3.1(~{SD}) Q1.3(D) R5.2
RTS0: MN16.8(T2IN) R122.2 RR7-2.2
RXD0: MN16.10(R1OUT) R121.2 R202.1
TXD0: MN16.7(T1IN) R120.2 RR7-3.2
VDDBU: C22.1 R23.2 ; port VDDBU  [project net PT3]
NetC1_1: C1.1 MN1.3(VOUT) MN2.1(SV)
NetC1_2: C1.2 J1.3 MN1.2(GND) MN2.2(SG)
NetC4_1: C4.1 JP1-4.2 L1.2 R1.2
NetC5_1: C5.1 R1.1
NetC7_1: C7.1 JP1-6.2 L2.2 R2.2
NetC9_1: C9.1 R2.1
NetC13_1: C13.1 Q2.1(G) R7.1
NetC17_1: C17.1 JP1-3.2 L3.2 R16.2
NetC19_1: C19.1 R16.1
NetC119_1: C119.1 MN14.2(V+)
NetC120_1: C120.1 MN14.1(C1+)
NetC120_2: C120.2 MN14.3(C1-)
NetC123_1: C123.1 MN14.4(C2+)
NetC123_2: C123.2 MN14.5(C2-)
NetC124_1: C124.1 MN14.6(V-)
NetC127_2: C127.2 MN16.1(V+)
NetC128_1: C128.1 MN16.6(C1+)
NetC128_2: C128.2 MN16.20(C1-)
NetC129_1: C129.1 MN16.2(C2+)
NetC129_2: C129.2 MN16.4(C2-)
NetC130_1: C130.1 MN16.21(V-)
NetC130_2: C130.2 MN16.23(GND)
NetC131_1: C131.1 MN16.24(C3+)
NetC131_2: C131.2 MN16.22(C3-)
NetD2_2: D2.2(K) R10.2
NetD3_2: D3.2(K) R11.2
NetD4_2: D4.2(K) R12.2
NetD5_2: D5.2(K) R13.2
NetFTDI_3: FTDI.3 R203.1 R204.2
NetFTDI_4: FTDI.4 MN14.14(T1OUT)
NetFTDI_5: FTDI.5 MN14.13(R1IN)
NetFTDI_6: FTDI.6 R205.1 R206.2
NetJ1_1: J1.1 J30.2
NetJ13_2: J13.2 MN16.15(R1IN)
NetJ13_3: J13.3 MN16.18(T1OUT)
NetJ13_7: J13.7 MN16.17(T2OUT)
NetJ13_8: J13.8 MN16.14(R2IN)
NetJ14_1: J14.1 J14.2 JP19.2
NetJ15_1: J15.1 J15.2 JP17.2
NetJ18_1: J18.1 J18.2 JP18.2
NetJ19_1: J19.1 J19.2 JP20.2
NetJ30_1: J30.1 MN1.1(VIN)
NetJP3_1: JP3.1 Q1.1(G) Q2.3(D) R4.1
NetJP11_1: JP11.1 MN12.1(A0) R83.1
NetMN3_5: MN3.5(ADJ) R3.1 R6.2
NetMN14_10: MN14.10(T2IN) R112.1
NetMN16_5: MN16.5(~{EN}) MN16.19(SD) R119.2 RR7-4.2
NetMN16_9: MN16.9(T3IN) RR7-1.2
NetMN16_13: MN16.13(R3IN) R124.2
NetMN16_16: MN16.16(T3OUT) R124.1

Not connected (* = marked no-connect by the designer): J1 2*; J13 1* 4* 6* 9*; J14 36*; J15 34* 36*; J19 6* 8* 10* 12* 14* 16* 18* 20* 22* 24* 25* 26* 27* 28* 29* 30* 31* 32* 33* 34* 35* 36*; MN14 7(T2OUT)* 8(R2IN)* 9(R2OUT)*; MN16 12(R3OUT)*; Q3 1 2 3; R13 1

### Buses and harness runs
bus PA[0..29] = port PA[0..29]
bus PB[0..31] = port PB[0..31]
bus PC[0..30] = port PC[0..30]
bus PD[0..10] = port PD[0..10]

### Notes on the sheet
- +5V TO +3V3
- VOLTAGE FEEDBACK
- (near BP4) BUTTONS
- (near J30) INPUT/EMI PROTECTION
- Serial EEPROM
- PIO EXPANSION
- (near MN14) UART
- (near MN16) RS232
- LEDS
- Labels drawn without touching a wire or pin: GND
- Title
- Size:
- Date:
- A3
- Number:
- Time:
- Revision:
- Sheet
- of
- File:

### Library data of the parts
BP1-BP4 = PTS645: Digi-Key Part Number CKN9112CT-ND; PackageDocument: Rev.0; Published: 6-Jun-2005; DatasheetDocument: Rev.0; PackageReference: IT-2175; Publisher: Altium Limited; ComponentLink1Description: Manufacturer Link; ComponentLink1URL: http://www.ilswitch.com/; ComponentLink2Description: Device Overview; ComponentLink2URL: http://www.ilswitch.com/list.php?ac_id=010112&ai_id=91
C1 C3-C5 C7-C15 C17-C19 C22 C100 C119-C121 C123-C131 = Cap Pol3: Polarized Capacitor (Surface Mount); Published: 8-Jun-2000; LatestRevisionDate: 29-May-2009; LatestRevisionNote: IPC-7351 Footprint Added.; PackageReference: C0805; Publisher: Altium Limited; PackageDescription: Chip Capacitor
C2 = Cap Pol3: Not sure if this one should be 0805?; Published: 8-Jun-2000; LatestRevisionDate: 29-May-2009; LatestRevisionNote: IPC-7351 Footprint Added.; PackageReference: C0805; Publisher: Altium Limited; PackageDescription: Chip Capacitor
D2 = LED2: Typical RED, GREEN, YELLOW, AMBER GaAs LED NO IDEA WHAT IS GOING ON WITH THE FOOTRPINTS; Published: 8-Jun-2000; LatestRevisionDate: 17-Jul-2002; LatestRevisionNote: Re-released for DXP Platform.; PackageVersion: Feb-2002; PackageReference: 3.2X1.6X1.1; Publisher: Altium Limited; PackageDescription: SM LED; 2 Flat Leads
D3 = LED2: Typical RED, GREEN, YELLOW, AMBER GaAs LED. NO IDEA WHAT IS GOING ON WITH THE FOOTPRINTS; Published: 8-Jun-2000; LatestRevisionDate: 17-Jul-2002; LatestRevisionNote: Re-released for DXP Platform.; PackageVersion: Feb-2002; PackageReference: 3.2X1.6X1.1; Publisher: Altium Limited; PackageDescription: SM LED; 2 Flat Leads
D4 = LED2: So I downloaded the footrpint off the net, but it seems to be dodgy, but for some reason the dims don't make sense; Published: 8-Jun-2000; LatestRevisionDate: 17-Jul-2002; LatestRevisionNote: Re-released for DXP Platform.; PackageVersion: Feb-2002; PackageReference: 3.2X1.6X1.1; Publisher: Altium Limited; PackageDescription: SM LED; 2 Flat Leads
D5 = LED2: Typical RED, GREEN, YELLOW, AMBER GaAs LED; Published: 8-Jun-2000; LatestRevisionDate: 17-Jul-2002; LatestRevisionNote: Re-released for DXP Platform.; PackageVersion: Feb-2002; PackageReference: 3.2X1.6X1.1; Publisher: Altium Limited; PackageDescription: SM LED; 2 Flat Leads
FTDI = Header 6: Header, 6-Pin; LatestRevisionDate: 17-Jul-2002; LatestRevisionNote: Re-released for DXP Platform.; Publisher: Altium Limited
J1 = MP179P 2.1mm: Digi-Key Part Number CP-002AHPJCT-ND
J13 = D Connector 9: Receptacle Assembly, 9 Position, Right Angle; Supplier: Digikey
J14 J15 J18 J19 = Header 20X2: Header, 20-Pin, Dual row; LatestRevisionDate: 17-Jul-2002; LatestRevisionNote: Re-released for DXP Platform.; Publisher: Altium Limited
J30 JP17-JP20 = Header 3: Header, 3-Pin; LatestRevisionDate: 17-Jul-2002; LatestRevisionNote: Re-released for DXP Platform.; Publisher: Altium Limited
JP1-1-JP1-6 JP3 JP11 = Header 2: Header, 2-Pin; Manufacturer: Molex; Supplier: Digikey; Supplier P/N: WM6440-ND; Manufacturer P/N: 22-28-4025
L1-L3 = Inductor: DigiKey: 587-1691-1-ND; Code_IEC: 1005; Published: 8-Jun-2000; LatestRevisionDate: 29-May-2009; LatestRevisionNote: IPC-7351 Footprint Added.; PackageReference: 0402-A; Publisher: Altium Limited; PackageDescription: Chip Inductor; Code_JEITA: 0402
MN1 = ZEN0656V130A: Digi-key number: ZEN056V130A24LSCT-ND
MN2 = BNX002-01: Digikey number: 490-5053-ND
MN3 = MIC29152WU: Mircel's 1.5A LDO TO263-5. Digikey Number: 576-3367-5-ND
MN12 = AT24C512C: Digikey Number: AT24C512C-SSHD-TCT-ND
MN14 = MAX3232CSE: Digikey Number: MAX3232CSE+-ND
MN16 = ADM3312EARU: Digikey Number: ADM3312EARUZ-ND
Q1 = IRLML6401: Digikey Part Number: IRLML6401PBFCT-ND
Q2 Q3 = IRLML2502: DigiKey Part no: IRLML2502PBFCT-ND
R1-R7 R10-R14 R16 R23 R83 R119 R200-R206 = 0805 Thick Film Resistor 1%
R111 R112 R120-R124 RR7-1-RR7-4 = 0805 Thick Film Resistor 1%_1: 0805 Thick Film Resistor 1%

## Nets that join several sheets
+3V3: MCU et al (9 pins), Other Components (48 pins)
+5V: MCU et al (R27.2), Other Components (10 pins)
P7: MCU et al (52 pins), Other Components (65 pins)
(URXD): MCU et al (MCU.27), Other Components (J15.21 MN14.12 R200.1)
(UTXD): MCU et al (MCU.2), Other Components (J15.23 MN14.11 R111.1)
CANRX0: MCU et al (MCU.24 R130.1), Other Components (J15.7)
CANRX0EN: MCU et al (MCU.92 R125.1 R129.2), Other Components (J18.16)
CANRX1: MCU et al (MCU.76 R137.1), Other Components (J18.35)
CANRX1EN: MCU et al (MCU.59 R132.1 R136.2), Other Components (J14.9)
CANTX0: MCU et al (MCU.23 R127.1), Other Components (J15.5)
CANTX0RS: MCU et al (MCU.91 R126.1), Other Components (J18.14)
CANTX1: MCU et al (MCU.140 R133.1), Other Components (J18.33)
CANTX1RS: MCU et al (MCU.55 R134.1), Other Components (J14.7)
COM0_EN: MCU et al (MCU.60), Other Components (J14.11 R119.1)
FWUP: MCU et al (MCU.53), Other Components (BP3.3 BP3.4 R23.1)
NRST: MCU et al (MCU.69 R18.1 R24.1), Other Components (BP1.3 BP1.4)
NRSTB: MCU et al (MCU.47), Other Components (BP2.3 BP2.4 C22.2)
P8: MCU et al (C45.1 MCU.52 R139.1 R140.1), Other Components (JP1-4.1)
P10: MCU et al (11 pins), Other Components (JP1-2.2)
PA2: MCU et al (MCU.85), Other Components (J15.9)
PA3: MCU et al (MCU.84), Other Components (J15.11)
PA4: MCU et al (MCU.83), Other Components (J15.13)
PA5: MCU et al (MCU.25), Other Components (J15.15)
PA6: MCU et al (MCU.82), Other Components (J15.17)
PA7: MCU et al (MCU.26), Other Components (J15.19)
PA10: MCU et al (MCU.3), Other Components (J15.25 R121.1)
PA11: MCU et al (MCU.4), Other Components (J15.27 R120.1)
PA12: MCU et al (MCU.5), Other Components (J15.29 R10.1)
PA13: MCU et al (MCU.6), Other Components (J15.31 R14.1)
PA14: MCU et al (MCU.7), Other Components (J15.33)
PA15: MCU et al (MCU.8), Other Components (J15.35)
PA16: MCU et al (MCU.78), Other Components (J15.6)
PA17: MCU et al (MCU.9), Other Components (J15.8 MN12.5)
PA18: MCU et al (MCU.70), Other Components (J15.10 MN12.6)
PA19: MCU et al (MCU.71), Other Components (J15.12)
PA20: MCU et al (MCU.72), Other Components (J15.14)
PA21: MCU et al (MCU.107), Other Components (J15.16)
PA22: MCU et al (MCU.81), Other Components (J15.18)
PA23: MCU et al (MCU.80), Other Components (J15.20)
PA24: MCU et al (MCU.79), Other Components (J15.22)
PA25: MCU et al (MCU.108), Other Components (J15.24)
PA26: MCU et al (MCU.109), Other Components (J15.26)
PA27: MCU et al (MCU.110), Other Components (J15.28)
PA28: MCU et al (MCU.111), Other Components (J15.30)
PA29: MCU et al (MCU.112), Other Components (J15.32)
PB0: MCU et al (MCU.113), Other Components (J18.5)
PB1: MCU et al (MCU.114), Other Components (J18.7)
PB2: MCU et al (MCU.115), Other Components (J18.9)
PB3: MCU et al (MCU.118), Other Components (J18.11)
PB4: MCU et al (MCU.119), Other Components (J18.13)
PB5: MCU et al (MCU.120), Other Components (J18.15)
PB6: MCU et al (MCU.121), Other Components (J18.17)
PB7: MCU et al (MCU.122), Other Components (J18.19)
PB8: MCU et al (MCU.123), Other Components (J18.21)
PB9: MCU et al (MCU.127), Other Components (J18.23)
PB10: MCU et al (MCU.128), Other Components (J18.25)
PB11: MCU et al (MCU.129), Other Components (J18.27)
PB12: MCU et al (MCU.86), Other Components (J18.29 R11.1)
PB13: MCU et al (MCU.87), Other Components (J18.31 R12.1)
PB16: MCU et al (MCU.77), Other Components (J18.6)
PB17: MCU et al (MCU.88), Other Components (J18.8)
PB18: MCU et al (MCU.89), Other Components (J18.10)
PB19: MCU et al (MCU.90), Other Components (J18.12)
PB22: MCU et al (MCU.141), Other Components (J18.18)
PB23: MCU et al (MCU.142), Other Components (BP4.3 BP4.4 J18.20)
PB24: MCU et al (MCU.143), Other Components (J18.22)
PB25: MCU et al (MCU.144), Other Components (J18.24 R123.1)
PB26: MCU et al (MCU.1), Other Components (J18.26 R122.1)
PB27: MCU et al (MCU.68), Other Components (J18.28)
PB28: MCU et al (J2.9 J2.11 MCU.28 R19.1), Other Components (J18.30)
PB29: MCU et al (J2.5 MCU.29 R20.1), Other Components (J18.32)
PB30: MCU et al (J2.13 MCU.30), Other Components (J18.34)
PB31: MCU et al (J2.7 MCU.31 R21.1), Other Components (J18.36)
PC0: MCU et al (MCU.130), Other Components (J14.5)
PC4: MCU et al (MCU.116), Other Components (J14.13)
PC5: MCU et al (MCU.63), Other Components (J14.15)
PC6: MCU et al (MCU.64), Other Components (J14.17)
PC7: MCU et al (MCU.65), Other Components (J14.19)
PC8: MCU et al (MCU.66), Other Components (J14.21)
PC9: MCU et al (MCU.67), Other Components (J14.23)
PC10: MCU et al (MCU.117), Other Components (J14.25)
PC11: MCU et al (MCU.93), Other Components (J14.27)
PC12: MCU et al (MCU.94), Other Components (J14.29)
PC13: MCU et al (MCU.95), Other Components (J14.31)
PC14: MCU et al (MCU.96), Other Components (J14.33)
PC15: MCU et al (MCU.97), Other Components (J14.35)
PC16: MCU et al (MCU.98), Other Components (J14.6)
PC17: MCU et al (MCU.99), Other Components (J14.8)
PC18: MCU et al (MCU.100), Other Components (J14.10)
PC19: MCU et al (MCU.101), Other Components (J14.12)
PC20: MCU et al (MCU.131), Other Components (J14.14)
PC21: MCU et al (MCU.132), Other Components (J14.16)
PC22: MCU et al (MCU.133), Other Components (J14.18)
PC23: MCU et al (MCU.134), Other Components (J14.20)
PC24: MCU et al (MCU.135), Other Components (J14.22)
PC25: MCU et al (MCU.136), Other Components (J14.24)
PC26: MCU et al (MCU.137), Other Components (J14.26)
PC27: MCU et al (MCU.138), Other Components (J14.28)
PC28: MCU et al (MCU.139), Other Components (J14.30)
PC29: MCU et al (MCU.102), Other Components (J14.32)
PC30: MCU et al (MCU.103), Other Components (J14.34)
PD0: MCU et al (MCU.13), Other Components (J19.5)
PD1: MCU et al (MCU.14), Other Components (J19.7)
PD2: MCU et al (MCU.15), Other Components (J19.9)
PD3: MCU et al (MCU.16), Other Components (J19.11)
PD4: MCU et al (MCU.17), Other Components (J19.13)
PD5: MCU et al (MCU.18), Other Components (J19.15)
PD6: MCU et al (MCU.19), Other Components (J19.17)
PD7: MCU et al (MCU.20), Other Components (J19.19)
PD8: MCU et al (MCU.21), Other Components (J19.21)
PD9: MCU et al (9 pins), Other Components (C12.1 J19.23 JP1-1.1)
PN1: MCU et al (C41.1 MCU.34), Other Components (JP1-3.1)
PT3: MCU et al (C43.1 MCU.41), Other Components (C22.1 R23.2)
PT5: MCU et al (MCU.50), Other Components (R7.2)
PT14: MCU et al (C49.1 MCU.73), Other Components (JP1-6.1)
PU7: MCU et al (MCU.56), Other Components (C15.1 C18.1 JP1-2.1 L3.1)
PU8: MCU et al (MCU.57), Other Components (C14.1 JP1-5.2)